# EAGLE design Kuga2 (EAGLE 7.6.0)
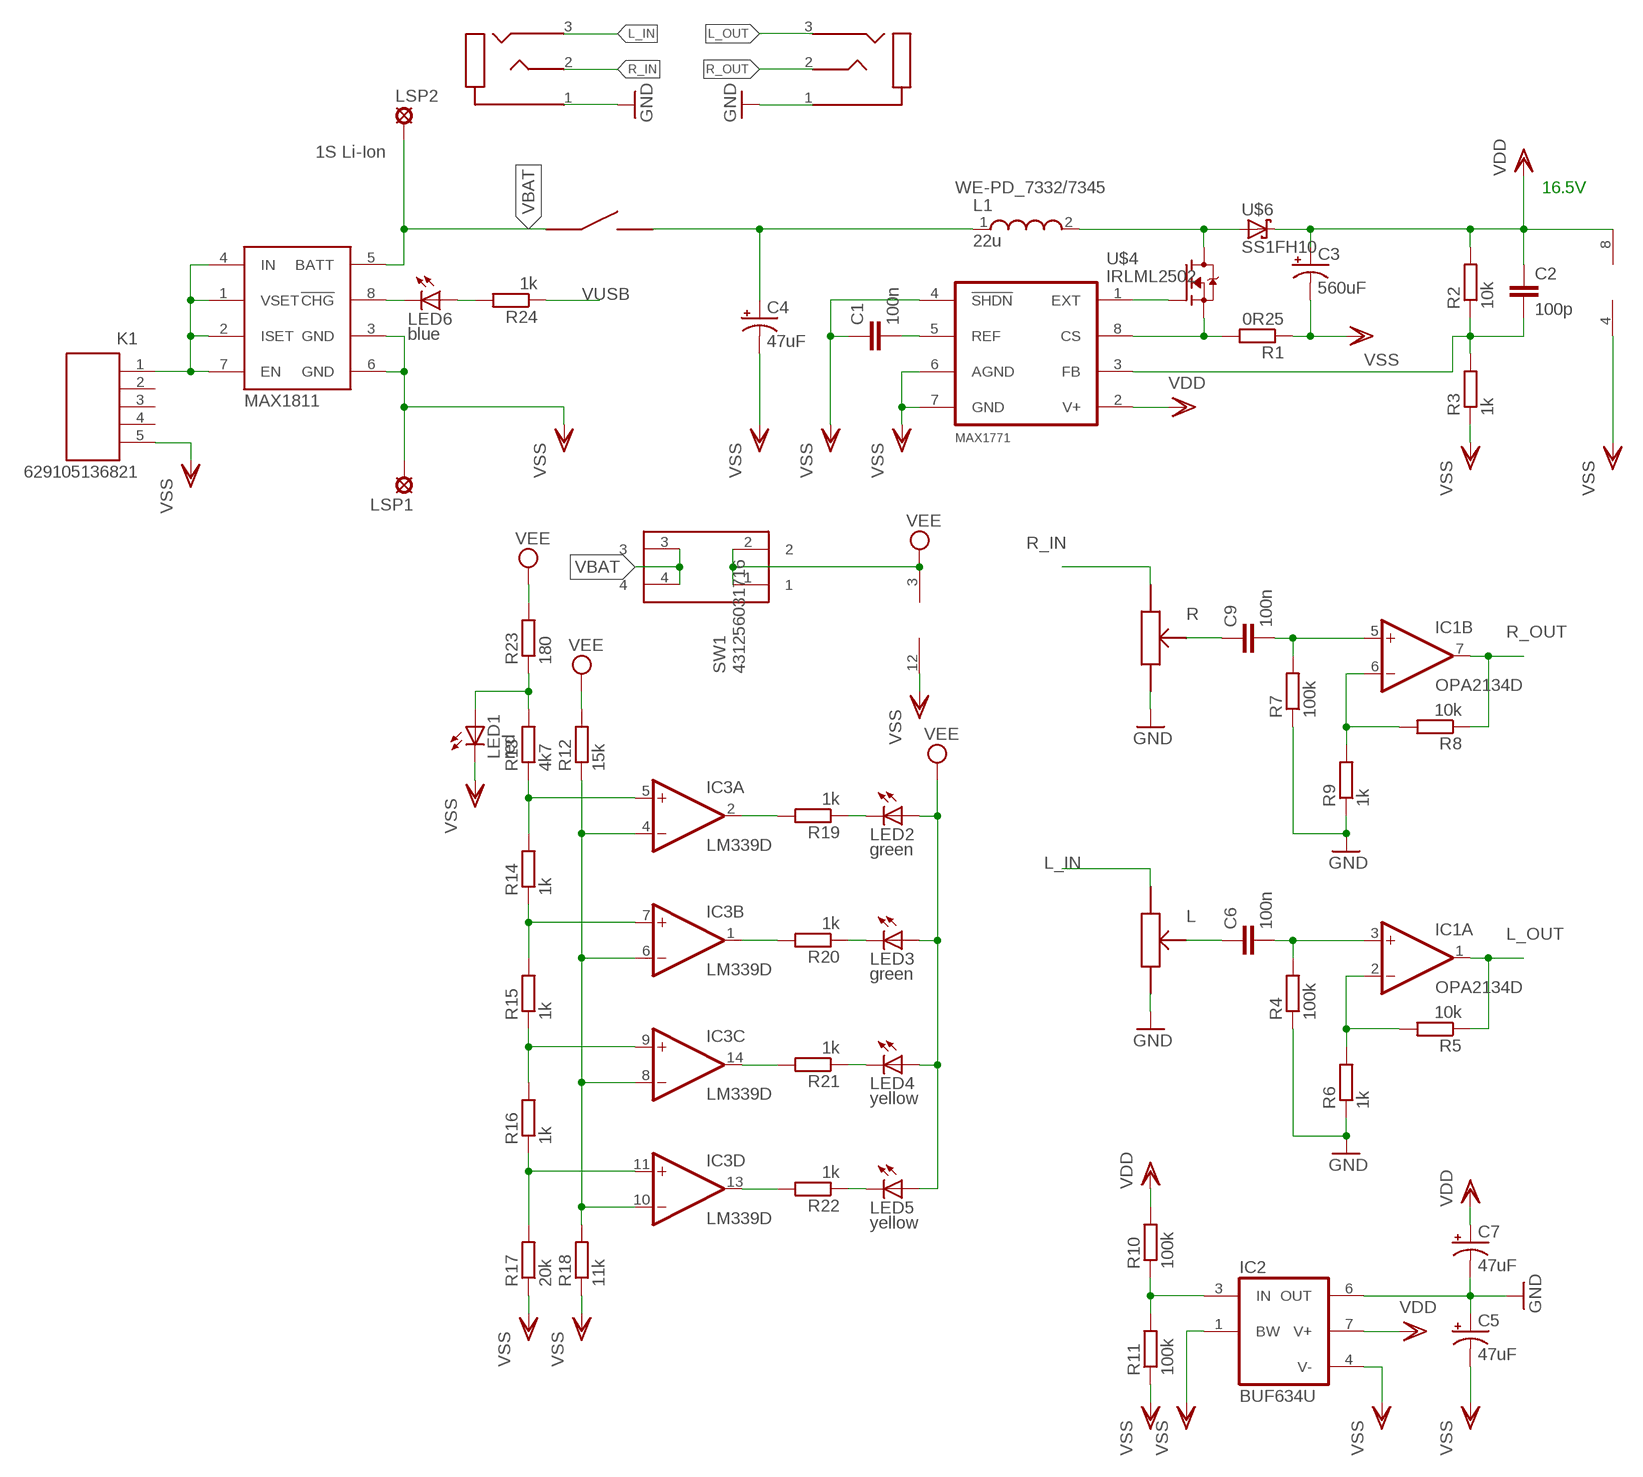
[diagram p0: schematic, sheet 1]

## Parts
C1  100n  C-EUC0603K  [C0603K]
C2  100p  C-EUC0603  [C0603]
C3  560uF  560UF-PANASONIC_G-25V-20%  [PANASONIC_G]
C4  47uF  47UF-POLAR-PANASONIC_D-35V-20%  [PANASONIC_D]
C5  47uF  47UF-POLAR-PANASONIC_D-35V-20%  [PANASONIC_D]
C6  100n  C-EUC1206  [C1206]
C7  47uF  47UF-POLAR-PANASONIC_D-35V-20%  [PANASONIC_D]
C9  100n  C-EUC1206  [C1206]
IC1  OPA2134D  [SOIC8]
IC2  BUF634U  [SO08]
IC3  LM339D  [SO14]
K1  629105136821  [629105136821]
L1  22u  WE-PD_7332/7345  [WE-PD_7332/7345]
LED1  red  LEDCHIP-LED0603  [CHIP-LED0603]
LED2  green  LEDCHIP-LED0603  [CHIP-LED0603]
LED3  green  LEDCHIP-LED0603  [CHIP-LED0603]
LED4  yellow  LEDCHIP-LED0603  [CHIP-LED0603]
LED5  yellow  LEDCHIP-LED0603  [CHIP-LED0603]
LED6  blue  LEDCHIP-LED0603  [CHIP-LED0603]
LSP1  LSP10  [LSP10]
LSP2  LSP10  [LSP10]
MAX1771  MAX1771  [SO-08]
MAX1811  MAX1811  [SO-08]
R1  0R25  R-EU_M3216  [M3216]
R2  10k  R-EU_R0603  [R0603]
R3  1k  R-EU_R0603  [R0603]
R4  100k  R-EU_R1206  [R1206]
R5  10k  R-EU_R1206  [R1206]
R6  1k  R-EU_R1206  [R1206]
R7  100k  R-EU_R1206  [R1206]
R8  10k  R-EU_R1206  [R1206]
R9  1k  R-EU_R1206  [R1206]
R10  100k  R-EU_R0603  [R0603]
R11  100k  R-EU_R0603  [R0603]
R12  15k  R-EU_R0603  [R0603]
R13  4k7  R-EU_R0603  [R0603]
R14  1k  R-EU_R0603  [R0603]
R15  1k  R-EU_R0603  [R0603]
R16  1k  R-EU_R0603  [R0603]
R17  20k  R-EU_R0603  [R0603]
R18  11k  R-EU_R0603  [R0603]
R19  1k  R-EU_R0603  [R0603]
R20  1k  R-EU_R0603  [R0603]
R21  1k  R-EU_R0603  [R0603]
R22  1k  R-EU_R0603  [R0603]
R23  180  R-EU_R0603  [R0603]
R24  1k  R-EU_R0603  [R0603]
SW1  431256031716  [431256031716]
U$1  SJ1-3515-SMT-TR  [STX-35332-3N-TR]
U$2  SJ1-3515-SMT-TR  [STX-35332-3N-TR]
U$4  IRLML2502  [SOT23]
U$5  PTR90  [PTR902]
U$6  SS1FH10  [DO-219AB]

## Nets
GND: C5.+ C7.- IC2.6(OUT) R4.1 R6.1 R7.1 R9.1 U$1.1(SLEEVE) U$2.1(SLEEVE) U$5.R13 U$5.R23
L: C6.1 U$5.R22
L_IN: U$2.3(RING) U$5.R21
L_OUT: IC1.1(A:OUT) R5.1 U$1.3(RING)
N$1: IC2.3(IN) R10.1 R11.2
N$2: C6.2 IC1.3(A:+IN) R4.2
N$3: IC1.2(A:-IN) R5.2 R6.2
N$4: C9.2 IC1.5(B:+IN) R7.2
N$5: MAX1771.8(CS) R1.2 U$4.2(S)
N$6: IC1.6(B:-IN) R8.2 R9.2
N$8: MAX1771.1(EXT) U$4.1(G)
N$9: L1.2 U$4.3(D) U$6.A
N$10: LED6.C MAX1811.8(!CHG)
N$11: LED6.A R24.2
N$13: IC3.4(A:-IN) IC3.6(B:-IN) IC3.8(C:-IN) IC3.10(D:-IN) R12.1 R18.2
N$14: C2.2 MAX1771.3(FB) R2.1 R3.2
N$15: IC3.5(A:+IN) R13.1 R14.2
N$16: C1.2 MAX1771.5(REF)
N$17: IC3.7(B:+IN) R14.1 R15.2
N$19: IC3.11(D:+IN) R16.1 R17.2
N$20: IC3.9(C:+IN) R15.1 R16.2
N$21: IC3.2(A:OUT) R19.2
N$22: IC3.1(B:OUT) R20.2
N$23: IC3.14(C:OUT) R21.2
N$24: IC3.13(D:OUT) R22.2
N$25: LED2.C R19.1
N$26: LED3.C R20.1
N$27: LED4.C R21.1
N$28: LED5.C R22.1
N$30: LED1.A R13.2 R23.1
R: C9.1 U$5.R12
R_IN: U$2.2(TIP) U$5.R11
R_OUT: IC1.7(B:OUT) R8.1 U$1.2(TIP)
VBAT: LSP2.MP MAX1811.5(BATT) SW1.3 SW1.4 U$5.SW1
VBATSW: C4.+ L1.1 U$5.SW2
VDD: C2.1 C3.+ C7.+ IC1.8(P:V+) IC2.7(V+) MAX1771.2(V+) R2.2 R10.2 U$6.K(C)
VEE: IC3.3(P:V+) LED2.A LED3.A LED4.A LED5.A R12.2 R23.2 SW1.1 SW1.2
VSS: C1.1 C3.- C4.- C5.- IC1.4(P:V-) IC2.1(BW) IC2.4(V-) IC3.12(P:GND) K1.5 LED1.C LSP1.MP MAX1771.4(!SHDN) MAX1771.6(AGND) MAX1771.7(GND) MAX1811.3(GND) MAX1811.6(GND) R1.1 R3.1 R11.1 R17.1 R18.1
VUSB: K1.1 MAX1811.1(VSET) MAX1811.2(ISET) MAX1811.4(IN) MAX1811.7(EN) R24.1
Unconnected: K1.2 K1.3 K1.4

## Notes on the sheet
- 1S Li-Ion
- WE-PD_7332/7345 | 16.5V

## Library data of the parts
C1 C2 C6 C9 = rcl:C-EU: CAPACITOR, European symbol
C3 = SparkFun-Capacitors:560UF: 560µF polarized capacitors A capacitor is a passive two-terminal electrical component used to store electrical energy temporarily in an electric field.; PROD_ID: CAP-09983
C4 C5 C7 = SparkFun-Capacitors:47UF-POLAR: 47µF polarized capacitors A capacitor is a passive two-terminal electrical component used to store electrical energy temporarily in an electric field.; PROD_ID: CAP-08478
IC1 = linear:OPA2134: SoundPLUS (TM) High Performance AUDIO OPERATIONAL AMPLIFIERS Source: http://focus.ti.com/lit/ds/sbos058/sbos058.pdf
IC2 = burr-brown:BUF634: 250mA High-Speed Buffer; MF: TEXAS INSTRUMENTS; MPN: BUF634U; OC_FARNELL: 4733617; OC_NEWARK: 27C6567
IC3 = linear:LM339: Low Power Low Offset Voltage Quad Comparators with open collector; LM139/LM239/LM339/LM2901/LM3302
K1 = Input-Output_Connectors_rev15d:629105136821: WR-COM SMT Horizontal 5 Contacts Micro USB Type B,5 pins=>Code : Con_I-O_COM_MicroUSB_629105136821 <http://katalog.we-online.de/media/images/eican/Con_I-O_COM_MicroUSB_629105136821_pf2.jpg> Details see: http://katalog.we-online.de/en/em/629_105_136_821 Created 2014-07-09, Karrer Zheng 2014 (C) Würth Elektronik
L1 = EagleLibrary_Wuerth_Elektronik_eiSos_rev16a:WE-PD: SMD Shielded Power Inductor Characteristics Magnetically shielded version which results in a low leakage field High Saturation currents up to 25 A Very low self-losses at high switching frequency‘s Wide inductances spectrum available at all sizes Operating temperature: –40 °C to +125 °C Applications Perfectly suitable for switching regulators with extremely high efficiency Integrated DC/DC- converter Switching regulators with low operating voltages (Graphic cards, embedded PC-Cards, Mainboards) Plastic base: Because of the one piece construction these are more suitable for high vibration or shock applications <http://katalog.we-online.de/media/images/eisos/FePBF_pf2.jpg> Details see: http://katalog.we-online.de/en/pbs/WE-PD? Updated by Dan Xu 2014-07-08 2014 (C) Wurth Elektronik
LED1-LED6 = led:LED: LED OSRAM: - CHIPLED LG R971, LG N971, LY N971, LG Q971, LY Q971, LO R971, LY R971 LH N974, LH R974 LS Q976, LO Q976, LY Q976 LO Q996 - Hyper CHIPLED LW Q18S LB Q993, LB Q99A, LB R99A - SideLED LS A670, LO A670, LY A670, LG A670, LP A670 LB A673, LV A673, LT A673, LW A673 LH A674 LY A675 LS A676, LA A676, LO A676, LY A676, LW A676 LS A679, LY A679, LG A679 - Hyper Micro SIDELED® LS Y876, LA Y876, LO Y876, LY Y876 LT Y87S - SmartLED LW L88C, LW L88S LB L89C, LB L89S, LG L890 LS L89K, LO L89K, LY L89K LS L896, LA L896, LO L896, LY L896 - TOPLED LS T670, LO T670, LY T670, LG T670, LP T670 LSG T670, LSP T670, LSY T670, LOP T670, LYG T670 LG T671, LOG T671, LSG T671 LB T673, LV T673, LT T673, LW T673 LH T674 LS T676, LA T676, LO T676, LY T676, LB T676, LH T676, LSB T676, LW T676 LB T67C, LV T67C, LT T67C, LS T67K, LO T67K, LY T67K, LW E67C LS E67B, LA E67B, LO E67B, LY E67B, LB E67C, LV E67C, LT E67C LW T67C LS T679, LY T679, LG T679 LS T770, LO T770, LY T770, LG T770, LP T770 LB T773, LV T773, LT T773, LW T773 LH T774 LS E675, LA E675, LY E675, LS T675 LS T776, LA T776, LO T776, LY T776, LB T776 LHGB T686 LT T68C, LB T68C - Hyper Mini TOPLED® LB M676 - Mini TOPLED Santana® LG M470 LS M47K, LO M47K, LY M47K Source: http://www.osram.convergy.de LUXEON: - LUMILED® LXK2-PW12-R00, LXK2-PW12-S00, LXK2-PW14-U00, LXK2-PW14-V00 LXK2-PM12-R00, LXK2-PM12-S00, LXK2-PM14-U00 LXK2-PE12-Q00, LXK2-PE12-R00, LXK2-PE12-S00, LXK2-PE14-T00, LXK2-PE14-U00 LXK2-PB12-K00, LXK2-PB12-L00, LXK2-PB12-M00, LXK2-PB14-N00, LXK2-PB14-P00, LXK2-PB14-Q00 LXK2-PR12-L00, LXK2-PR12-M00, LXK2-PR14-Q00, LXK2-PR14-R00 LXK2-PD12-Q00, LXK2-PD12-R00, LXK2-PD12-S00 LXK2-PH12-R00, LXK2-PH12-S00 LXK2-PL12-P00, LXK2-PL12-Q00, LXK2-PL12-R00 Source: www.luxeon.com KINGBRIGHT: KA-3528ASYC Source: www.kingbright.com
LSP1 LSP2 = solpad:LSP10: SOLDER PAD drill 1.0 mm, distributor Buerklin, 12H555
MAX1771 = Kuga2_parts:MAX1771
MAX1811 = Kuga2_parts:MAX1811
R1-R24 = rcl:R-EU_: RESISTOR, European symbol
SW1 = Switches_rev16a:431256031716: WS-TST, 6*6mm right angle Tact switch,THT, height 3.15mm, 4 pins, black actuator, 160gf
U$1 U$2 = Kuga2_parts:SJ1-3515-SMT-TR
U$4 = Kuga2_parts:IRLML2502
U$5 = Kuga2_parts:PTR90
U$6 = Kuga2_parts:SS1FH10

## Board
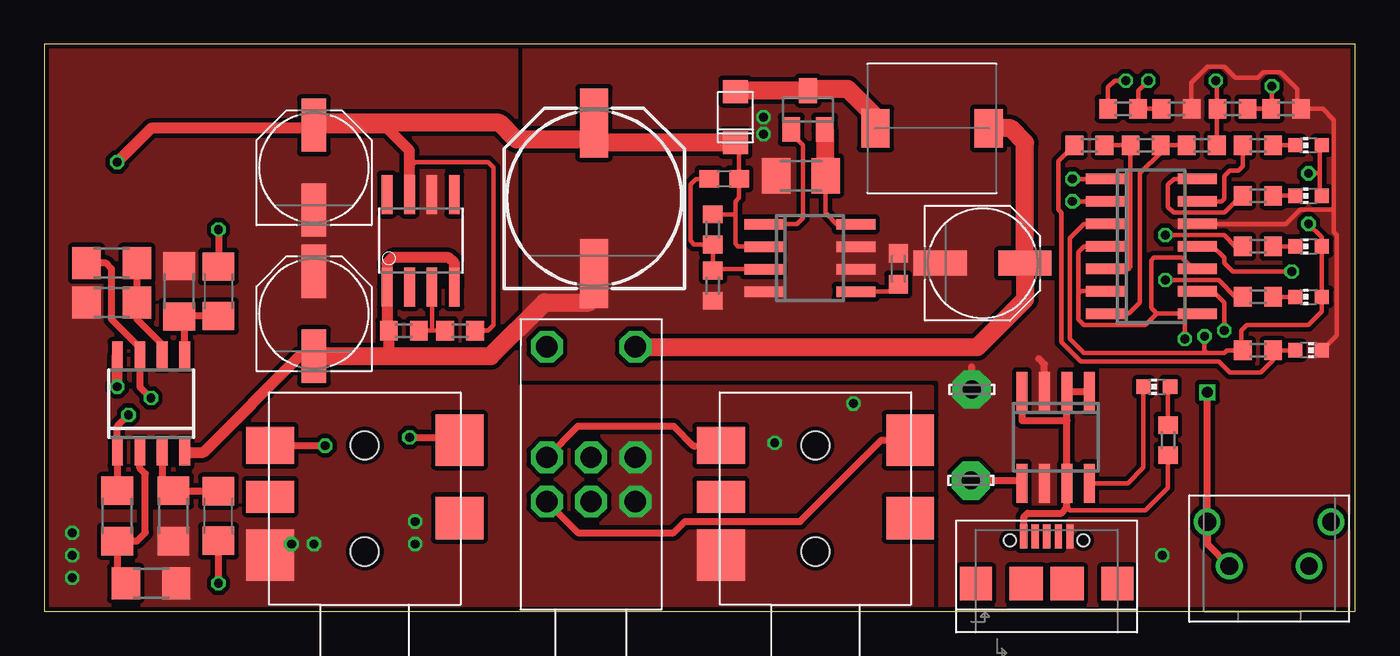
[diagram p1: board, top side]
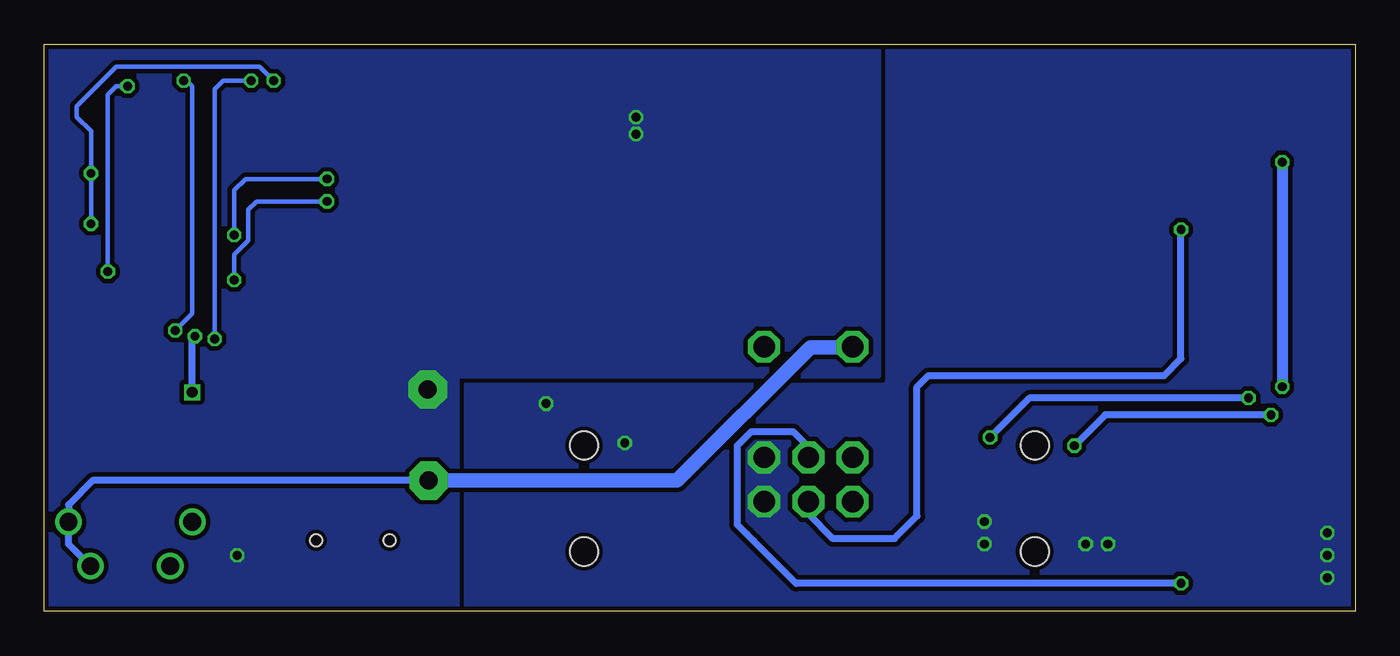
[diagram p2: board, bottom side, seen from below]

Size 74.08 x 32.06 mm. Coordinates in mm from the lower left corner, seen from the top.
Outline: 0,0 74.08,0 74.08,32.06 0,32.06 0,0
Copper layers (1*16): Top 0.035mm / dielectric 1.5mm / Bottom 0.035mm
Design rules "SeeedStudio_2layer_DRU_no_angle_20140221": minimum track width 6mil, minimum drill 12mil, track to track 6mil, track to pad 6mil, pad to pad 6mil, via to via 6mil, smd to smd 0mil, copper to edge 10mil, drill to drill 10mil, minimum pad ring 10mil, minimum via ring 6mil, stop-mask expansion 2mil, vias tented up to drill 100mil, thermal gap 10mil

### Footprints (pad centres in the part's own frame; a part is rotated, then mirrored left to right if it is on the bottom)
C0603K = smd 1.05 x 1.08: 1 -0.875,0; 2 0.875,0
C0603 = smd 1.1 x 1: 1 -0.85,0; 2 0.85,0
PANASONIC_G = smd 3.9 x 1.6: + 4.25,0; - -4.25,0
PANASONIC_D = smd 3 x 1.4: + 2.4,0; - -2.4,0
C1206 = smd 1.6 x 1.8: 1 -1.4,0; 2 1.4,0
SOIC8 = smd 0.6 x 1.5: 1 -1.905,-2.75; 2 -0.635,-2.75; 3 0.635,-2.75; 4 1.905,-2.75; 5 1.905,2.75; 6 0.635,2.75; 7 -0.635,2.75; 8 -1.905,2.75
SO08 = smd 0.61 x 2.21: 1 -1.905,-2.616; 2 -0.635,-2.616; 3 0.635,-2.616; 4 1.905,-2.616; 5 1.905,2.616; 6 0.635,2.616; 7 -0.635,2.616; 8 -1.905,2.616
SO14 = smd 0.6 x 2.2: 1 -3.81,-2.6; 2 -2.54,-2.6; 3 -1.27,-2.6; 4 0,-2.6; 5 1.27,-2.6; 6 2.54,-2.6; 7 3.81,-2.6; 8 3.81,2.6; 9 2.54,2.6; 10 1.27,2.6; 11 0,2.6; 12 -1.27,2.6; 13 -2.54,2.6; 14 -3.81,2.6
629105136821 = smd 0.4 x 1.35: 1 -1.3,0; 2 -0.65,0; 3 0,0; 4 0.65,0; 5 1.3,0 | smd 1.8 x 1.9: Z1 -4,-2.675; Z4 4,-2.675 | smd 1.9 x 1.9: Z2 -1.15,-2.675; Z3 1.15,-2.675 | hole 0.7: -2.075,-0.225; 2.075,-0.225
WE-PD_7332/7345 = smd 1.6 x 2.2: 1 -3.2,0; 2 3.2,0
CHIP-LED0603 = smd 0.8 x 0.8: A 0,-0.75; C 0,0.75
LSP10 = drill 1.016 pad 2.159 octagon: MP 0,0
SO-08 = smd 0.6 x 2.2: 1 -1.905,-2.6; 2 -0.635,-2.6; 3 0.635,-2.6; 4 1.905,-2.6; 5 1.905,2.6; 6 0.635,2.6; 7 -0.635,2.6; 8 -1.905,2.6
M3216 = smd 1.6 x 2: 1 -1.4,0; 2 1.4,0
R0603 = smd 1 x 1.1: 1 -0.85,0; 2 0.85,0
R1206 = smd 1.6 x 1.803: 1 -1.422,0; 2 1.422,0
431256031716 = drill 1: 1 -3.5,1.25; 2 -2.25,-1.25; 3 2.25,-1.25; 4 3.5,1.25
STX-35332-3N-TR = smd 2.9 x 2.7: 1 2.8,5.35; 2 9.3,-5.35 | smd 2.1 x 2.7: 3 9,5.35 | smd 2.4 x 2.7: 10 4.9,-5.35 | smd 1.8 x 2.7: 11 6.1,5.35 | hole 1.6: 3,0; 9,0
SOT23 = smd 1 x 1.4: 1 -0.95,-1.1; 2 0.95,-1.1; 3 0,1.1
PTR902 = drill 1.2 octagon: R11 2.5,-2.5; R12 2.5,0; R13 2.5,2.5; R21 0,-2.5; R22 0,0; R23 0,2.5; SW1 -6.25,-2.5; SW2 -6.25,2.5
DO-219AB = smd 1.3 x 1.4: A -1.45,0; K 1.45,0

### Placement (x,y rotation side)
C1  48.26,19.37 270 top
C2  38.42,24.45 180 top
C3  31.07,23.36 90 top
C4  53.02,19.68 0 top
C5  15.24,16.83 90 top
C6  9.84,5.4 90 top
C7  15.24,25.08 90 top
C9  9.84,18.1 270 top
IC1  6.03,11.75 0 top
IC2  21.27,20.95 0 top
IC3  62.55,20.64 270 top
K1  56.64,4.24 0 top
L1  50.16,27.3 180 top
LED1  71.44,14.76 270 top
LED2  71.44,17.78 90 top
LED3  71.44,20.64 90 top
LED4  71.44,23.5 90 top
LED5  71.44,26.35 90 top
LED6  62.87,12.7 90 top
LSP1  52.41,12.55 0 top
LSP2  52.36,7.4 0 top
MAX1771  43.26,19.98 270 top
MAX1811  57.15,9.84 180 top
R1  42.76,24.63 0 top
R2  37.78,21.59 90 top
R3  37.78,18.41 90 top
R4  7.3,5.4 90 top
R5  4.13,5.4 270 top
R6  6.03,1.59 180 top
R7  7.62,18.1 270 top
R8  3.81,19.68 0 top
R9  3.81,17.46 0 top
R10  23.49,15.88 0 top
R11  20.32,15.88 0 top
R12  60.96,28.42 180 top
R13  59.05,26.35 180 top
R14  62.23,26.35 180 top
R15  65.41,26.35 180 top
R16  67.15,28.42 180 top
R17  70.17,28.42 180 top
R18  63.98,28.42 180 top
R19  68.58,17.78 180 top
R20  68.58,20.64 180 top
R21  68.58,23.5 180 top
R22  68.58,26.35 180 top
R23  68.58,14.76 180 top
R24  63.5,9.68 90 top
SW1  69.22,3.81 0 top
U$1  18.11,0.38 90 top
U$2  43.58,0.38 90 top
U$4  43.16,28.34 0 top
U$5  30.9,8.71 270 top
U$6  39.05,27.94 270 top

### Tracks (layer width: path | path; a pad name or v marks a point on that pad's centre or on a via)
GND  (via drill 0.5)
  other vias: 13.97,3.81 15.24,3.81 20.95,3.81 20.95,5.08 1.59,3.17 1.59,4.45 1.59,1.91 41.28,9.53 45.72,11.75
  pour Top (isolate 0.254, no thermals): 21.27,24.77 21.27,22.23 18.73,22.23 16.83,24.13 14.61,24.13 14.61,17.78 16.83,17.78 18.73,19.68 22.22,19.68 22.54,20 22.54,24.77
  pour Top (isolate 0.254, no thermals): 0,32.07 26.67,32.07 26.67,12.7 50.16,12.7 50.16,0 0,0
  pour Bottom (isolate 0.254, rank 2, no thermals): 0,32.38 26.67,32.38 26.67,13.02 50.48,13.02 50.48,0 0,0
L  (via drill 0.5)
  Top 0.406: v9.84,1.59 C6.1
  Bottom 0.406: U$5.R22 30.9,9.31 31.75,10.16 34.13,10.16 34.93,9.37 34.93,4.92 34.37,4.37 33.97,3.97 31.59,1.59 v9.84,1.59
L_IN
  Top 0.406: U$5.R21 30.16,10.48 35.56,10.48 36.67,9.37 38.22,9.37 U$2.3
L_OUT  (via drill 0.5)
  Top 0.406: R5.1 IC1.1 4.13,10.48 v4.76,11.11 | v15.88,9.37 12.78,9.37 U$1.3
  Bottom 0.406: v4.76,11.11 14.13,11.11 v15.88,9.37
N$1
  Top 0.254: R11.2 21.91,15.88 | 21.91,15.88 R10.1 | IC2.3 21.91,15.88
N$2
  Top 0.406: IC1.3 6.67,7.46 R4.2 9.82,6.82 C6.2
N$3
  Top 0.406: R6.2 4.13,2.07 R5.2 5.25,3.98 5.71,4.45 5.71,7.78 5.4,8.1 IC1.2
N$4
  Top 0.406: C9.2 7.64,16.7 R7.2 7.94,16.36 IC1.5
N$5
  Top 0.254: MAX1771.8 44.79,21.88 44.13,22.54 44.13,24.6 R1.2
  Top 1.016: U$4.2 44.11,24.68 R1.2
N$6
  Top 0.406: R8.2 R9.2 | IC1.6 6.67,15.08 5.24,16.51 R9.2
  Top 0.61: R9.2
N$8
  Top 0.254: U$4.1 42.21,27.01 42.86,26.35 42.86,22.23 42.54,21.91 40.69,21.91 MAX1771.1
N$9
  Top 1.016: L1.2 46.97,27.96 45.4,29.53 43.24,29.53 U$4.3 39.11,29.44 U$6.A
N$10
  Top 0.254: MAX1811.8 61.22,7.24 62.12,8.14 LED6.C
N$11
  Top 0.254: R24.2 63.5,12.59 LED6.A
N$13  (via drill 0.5)
  Top 0.254: R18.2 R12.1 61.81,29.43 v62.39,30 | IC3.8 64.45,16.83 | 64.45,16.83 62.87,16.83 | 62.87,16.83 62.55,17.14 62.55,19.84 62.71,20 64.29,20 64.93,19.37 IC3.10 | IC3.4 58.74,20.64 58.42,20.32 58.42,17.94 | 58.42,17.94 58.42,16.51 58.74,16.19 62.23,16.19 62.87,16.83 | v64.45,15.4 64.45,16.83 | IC3.6 58.58,18.1 58.42,17.94
  Bottom 0.254: v62.39,30 63.98,30 64.45,29.53 v64.45,15.4
N$14
  Top 0.254: MAX1771.3 37.78,19.34 R3.2 R2.1 36.73,20.74 36.51,20.95 36.51,24.13 36.83,24.45 C2.2
N$15
  Top 0.254: R13.1 R14.2 61.38,19.47 61.28,19.37 IC3.5
N$16
  Top 0.254: MAX1771.5 47.84,18.07 C1.2
N$17
  Top 0.254: R15.2 R14.1 63.08,25.93 61.91,24.77 61.91,17.46 61.28,16.83 IC3.7
N$19  (via drill 0.5)
  Top 0.254: R16.1 R17.2 69.37,28.47 v69.37,29.69 | IC3.11 66.04,20.64 66.67,20 66.67,19.68 67.15,19.21 v70.48,19.21
  Bottom 0.254: v70.48,19.21 70.48,29.21 70.01,29.69 v69.37,29.69
N$20  (via drill 0.5)
  Top 0.254: R15.1 66.25,28.37 | 66.25,28.37 R16.2 | 66.25,28.37 66.25,29.95 v66.2,30 | v66.67,15.88 66.67,17.46 66.04,18.1 IC3.9
  Bottom 0.254: v66.2,30 66.04,30 65.72,29.69 65.72,16.83 v66.67,15.88
N$21  (via drill 0.5)
  Top 0.254: R19.2 67.31,17.78 66.36,18.73 v63.34,18.73 | v58.1,23.18 IC3.2
  Bottom 0.254: v63.34,18.73 63.34,20.16 62.55,20.95 62.55,22.7 62.07,23.18 v58.1,23.18
N$22  (via drill 0.5)
  Top 0.254: R20.2 67.31,20.64 66.67,21.27 v63.34,21.27 | v58.1,24.45 IC3.1
  Bottom 0.254: v63.34,21.27 63.34,23.81 62.71,24.45 v58.1,24.45
N$23
  Top 0.254: R21.2 67.63,23.5 66.67,22.54 63.82,22.54 63.5,22.86 63.5,24.13 63.82,24.45 IC3.14
N$24
  Top 0.254: R22.2 67.73,25.18 67.47,24.92 66.99,24.92 66.67,24.61 66.67,23.34 66.52,23.18 IC3.13
N$25
  Top 0.254: R19.1 LED2.C
N$26
  Top 0.254: R20.1 LED3.C
N$27
  Top 0.254: R21.1 LED4.C
N$28
  Top 0.254: R22.1 LED5.C
N$30
  Top 0.254: LED1.A R23.1 69.43,14.19 68.74,13.49 66.99,13.49 66.36,14.13 58.58,14.13 57.47,15.24 57.47,22.54 57.31,22.7 57.31,25.46 R13.2
R  (via drill 0.5)
  Top 0.406: v9.84,21.59 C9.1
  Bottom 0.406: U$5.R12 30.9,5.5 29.53,4.13 26.04,4.13 24.76,5.4 24.76,12.7 24.13,13.34 10.79,13.34 9.84,14.29 v9.84,21.59
R_IN
  Top 0.406: U$5.R11 30.16,4.45 35.56,4.45 36.19,5.08 42.7,5.08 47.31,9.68 U$2.2
R_OUT  (via drill 0.5)
  Top 0.406: R8.1 3.49,19.68 3.81,19.37 3.81,16.51 5.4,14.92 IC1.7 5.4,12.7 v6.03,12.06 | v20.64,9.84 23.3,9.84 U$1.2
  Bottom 0.406: v6.03,12.06 18.42,12.06 v20.64,9.84
VBAT
  Top 0.406: LSP2.MP 55.09,7.4 MAX1811.5
  Bottom 0.406: SW1.3 72.72,3.81 SW1.4 72.71,6.03 71.34,7.4 LSP2.MP
  Bottom 0.813: LSP2.MP 38.32,7.4 30.8,14.92 28.44,14.92 U$5.SW1
VBATSW
  Top 1.016: L1.1 54.61,27.3 55.42,26.49 C4.+ 55.42,17.64 52.71,14.92 33.44,14.92 U$5.SW2
VDD  (via drill 0.5)
  Top 0.254: 39.05,22.54 39.05,23.18 39.27,23.39 C2.1 39.27,26.27 U$6.K | 39.05,22.54 39.05,20.8 39.21,20.64 40.64,20.64 MAX1771.2 | R2.2 38.95,22.44 39.05,22.54 | R10.2 25.08,15.88 25.4,16.19 25.4,25.08 25.08,25.4 20.95,25.4 20.64,25.08
  Top 0.61: IC2.7 20.64,25.08 20.64,26.04 19.37,27.3 15.42,27.3 | 15.42,27.3 C7.+ | 15.42,27.3 6.03,27.3 v4.13,25.4 | v4.13,12.7 IC1.8
  Top 1.016: U$6.K 31.29,26.49 31.11,26.67 | 31.11,26.67 31.11,27.57 C3.+ | 31.11,26.67 26.67,26.67 25.72,27.62 15.38,27.62 C7.+
  Bottom 0.61: v4.13,25.4 v4.13,12.7
VEE  (via drill 0.5, 0.6)
  Top 0.254: 65.72,14.61 66.67,14.61 66.83,14.76 R23.2 67.63,14.71 67.63,15.88 67.95,16.19 71.44,16.19 72.19,16.94 LED2.A LED3.A 72.19,21.16 v71.44,21.91 | 65.72,14.61 58.74,14.61 57.94,15.4 57.94,21.11 58.74,21.91 IC3.3 | v71.44,24.77 72.07,24.77 | 72.07,24.77 72.07,23.61 LED4.A | 72.07,24.77 72.07,26.24 LED5.A | R12.2 60.11,29.63 60.48,30 v61.12,30 | v65.56,15.56 65.56,14.76 65.72,14.61
  Top 0.406: SW1.2 65.72,3.81 SW1.1 v65.72,12.38
  Bottom 0.254: v71.44,21.91 v71.44,24.77 71.44,27.15 72.23,27.94 72.23,28.57 70.01,30.8 61.91,30.8 v61.12,30
  Bottom 0.406: v65.72,12.38 65.72,15.4 v65.56,15.56
VSS  (via drill 0.5)
  Top 0.254: R18.1 64.83,29.9 65.72,30.8 66.67,30.8 67.31,30.16 68.58,30.16 68.9,30.48 69.85,30.48 70.8,29.53 70.8,28.63 R17.1 72.23,28.42 72.87,27.78 72.87,22.7 | IC3.12 70.17,21.91 70.96,22.7 72.87,22.7 | 72.87,22.7 72.87,21.43 73.03,21.27 73.03,15.6 LED1.C 72.23,14.72 | 19.37,15.98 R11.1 | 19.47,14.53 19.37,14.43
  Top 0.406: MAX1811.3 56.51,13.97 56.2,14.29 | LSP1.MP 52.41,13.83
  Top 0.61: IC2.4 23.18,19.68 22.86,20 19.68,20 19.37,19.68 IC2.1 19.37,15.98 | R11.1 19.47,14.53 | C5.- 14.43,14.43 9,9 IC1.4
  Top 1.016: C5.- 19.37,14.43 25.22,14.43 28.26,17.46 30.8,17.46 31.11,17.78 31.11,19.07 C3.-
  other vias: 40.64,26.99 40.64,27.94 63.18,3.17
  pour Top (isolate 0.254, rank 2, no thermals): 26.99,32.07 26.99,13.02 50.48,13.02 50.48,0.32 50.48,0 73.98,0 73.98,32.07
  pour Bottom (isolate 0.254, no thermals): 26.99,32.07 26.99,13.34 50.8,13.34 50.8,0 73.98,0 73.98,32.07
VUSB
  Top 0.254: 57.79,5.87 57.94,5.71 62.23,5.71 63.5,6.99 R24.1
  Top 0.406: K1.1 55.34,5.34 55.56,5.56 57.47,5.56 57.79,5.87 MAX1811.7 57.79,10.79 | 57.79,10.79 MAX1811.2 MAX1811.1 | MAX1811.4 55.25,10.79 57.79,10.79

### Text on the board
Document: not visible